# Altium schematic sheet pH-meter.SchDoc
size A4
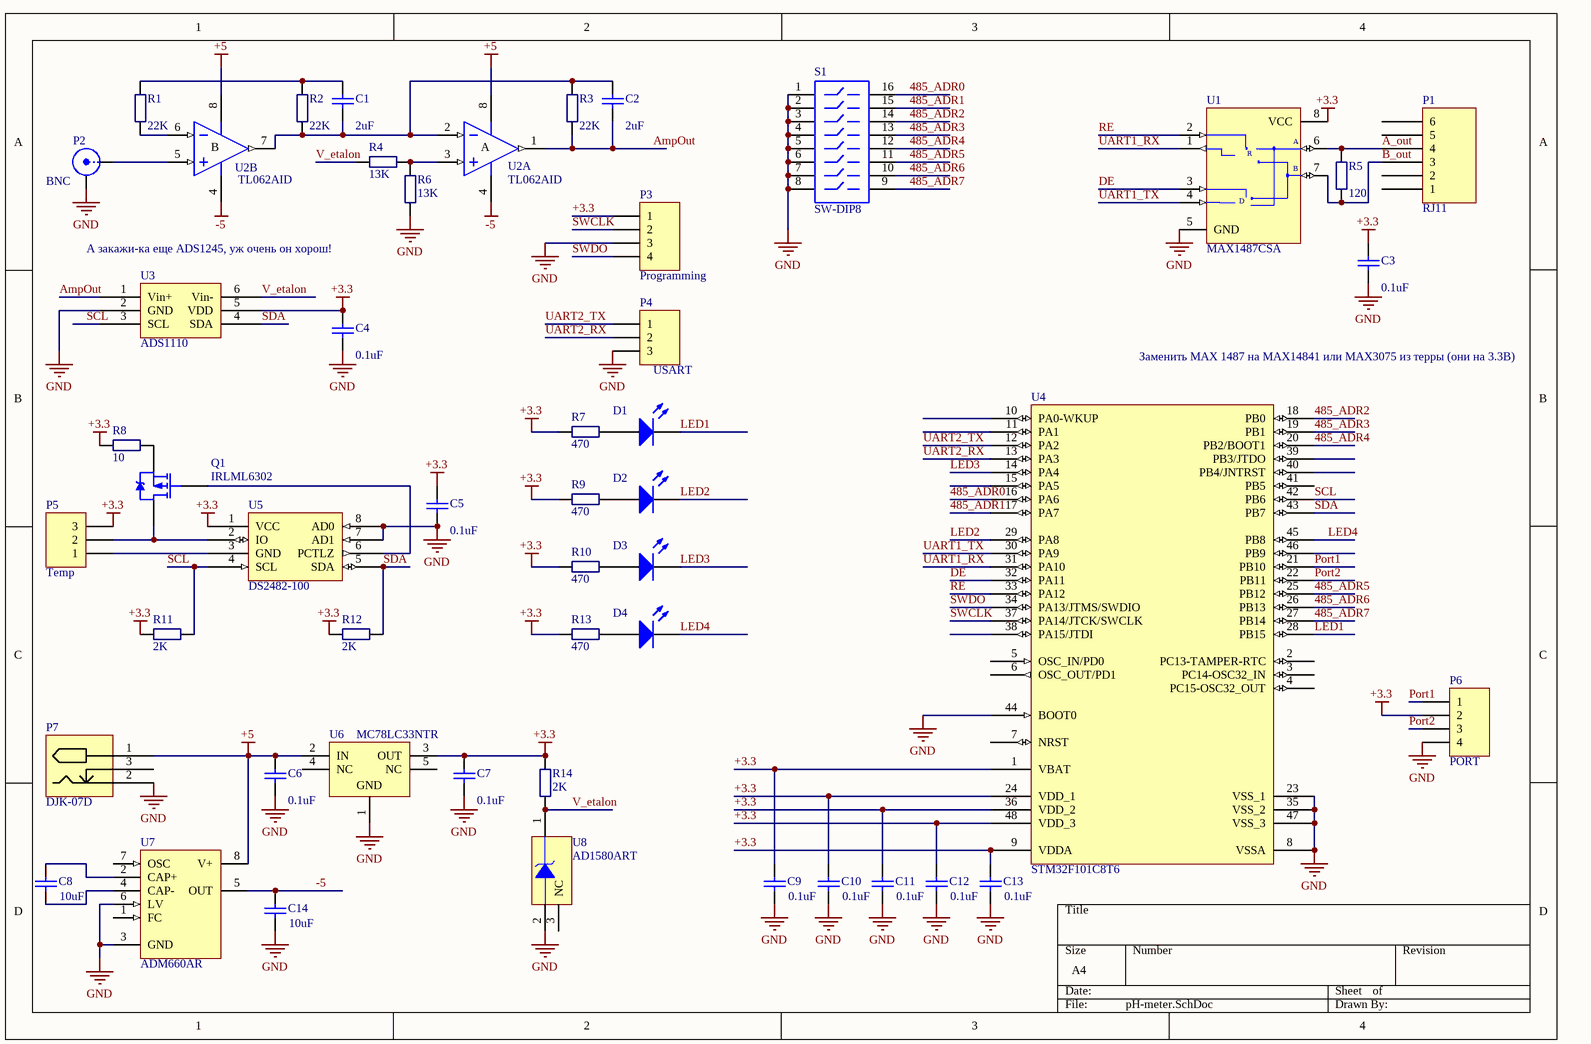
[diagram p0: pH-meter.SchDoc]

## Parts
C1  value 2uF  [1608[0603]]  (hidden comment: Cap Semi)
C2  value 2uF  [1608[0603]]  (hidden comment: Cap Semi)
C3  value 0.1uF  [1608[0603]]  (hidden comment: Cap Semi)
C4  value 0.1uF  [1608[0603]]  (hidden comment: Cap Semi)
C5  value 0.1uF  [1608[0603]]  (hidden comment: Cap Semi)
C6  value 0.1uF  [1608[0603]]  (hidden comment: Cap Semi)
C7  value 0.1uF  [1608[0603]]  (hidden comment: Cap Semi)
C8  value 10uF  [1608[0603]]  (hidden comment: Cap Semi)
C9  0.1uF  [1608[0603]]
C10  0.1uF  [1608[0603]]
C11  0.1uF  [1608[0603]]
C12  0.1uF  [1608[0603]]
C13  0.1uF  [1608[0603]]
C14  value 10uF  [1608[0603]]  (hidden comment: Cap Semi)
D1  LED1  [LED-1]  (value not drawn)
D2  LED1  [LED-1]  (value not drawn)
D3  LED1  [LED-1]  (value not drawn)
D4  LED1  [LED-1]  (value not drawn)
P1  RJ11  [RJ11_6]
P2  BNC  [BNC_RA CON]
P3  Programming  [HDR1X4]
P4  USART  [HDR1X3]
P5  Temp  [HDR1X3]
P6  PORT  [HDR1X4]
P7  DJK-07D  [DJK-07D]
Q1  IRLML6302  [SOT-23_N]
R1  value 22K  [J1-0603]  (hidden comment: Res_SMD)
R2  value 22K  [J1-0603]  (hidden comment: Res_SMD)
R3  value 22K  [J1-0603]  (hidden comment: Res_SMD)
R4  value 13K  [J1-0603]  (hidden comment: Res_SMD)
R5  value 120  [J1-0603]  (hidden comment: Res_SMD)
R6  value 13K  [J1-0603]  (hidden comment: Res_SMD)
R7  470  [J1-0603]
R8  value 10  [J1-0603]  (hidden comment: Res_SMD)
R9  470  [J1-0603]
R10  470  [J1-0603]
R11  value 2K  [J1-0603]  (hidden comment: Res_SMD)
R12  value 2K  [J1-0603]  (hidden comment: Res_SMD)
R13  470  [J1-0603]
R14  value 2K  [J1-0603]  (hidden comment: Res_SMD)
S1  SW-DIP8  [DIP-16-KEY]
U1  MAX1487CSA  [NSO8_N]
U2  TL062AID  [SO8_N]  (parts A,B of 2)
U3  ADS1110  [SOT-23_A]
U4  STM32F101C8T6  [LQFP48_N]
U5  DS2482-100  [NSO8_L]
U6  MC78LC33NTR  [1212-01]
U7  ADM660AR  [SO-8_N]
U8  AD1580ART  [RT-3_N]

## Nets
+3.3: C3.2 C4.2 C5.2 C7.2 C9.2 C10.2 C11.2 C12.2 C13.2 P3.1 P5.3 P6.2 R7.2 R8.1 R9.2 R10.2 R11.2 R12.2 R13.2 R14.2 U1.8(VCC) U3.5(VDD) U4.1(VBAT) U4.9(VDDA) U4.24(VDD_1) U4.36(VDD_2) U4.48(VDD_3) U5.1(VCC) U6.3(OUT)
+5: C6.2 P7.1 U2.8(V+) U6.2(IN) U7.8(V+)
-5: C14.2 U2.4(V-) U7.5(OUT)
GND: C3.1 C4.1 C5.1 C6.1 C7.1 C9.1 C10.1 C11.1 C12.1 C13.1 C14.1 P2.2(Y) P3.3 P4.3 P6.4 P7.2 R6.1 S1.1 S1.2 S1.3 S1.4 S1.5 S1.6 S1.7 S1.8 U1.5(GND) U3.2(GND) U4.8(VSSA) U4.23(VSS_1) U4.35(VSS_2) U4.44(BOOT0) U4.47(VSS_3) U5.7(AD1) U5.8(AD0) U6.1(GND) U7.3(GND) U7.6(LV) U8.2(V-)
485_ADR0: S1.16 U4.16(PA6)
485_ADR1: S1.15 U4.17(PA7)
485_ADR2: S1.14 U4.18(PB0)
485_ADR3: S1.13 U4.19(PB1)
485_ADR4: S1.12 U4.20(PB2/BOOT1)
485_ADR5: S1.11 U4.25(PB12)
485_ADR6: S1.10 U4.26(PB13)
485_ADR7: S1.9 U4.27(PB14)
A_out: P1.4 R5.1 U1.6(A)
AmpOut: C2.1 R3.2 U2.1(OUT) U3.1(Vin+)
B_out: P1.3 R5.2 U1.7(B)
DE: U1.3(DE) U4.32(PA11)
LED1: D1.2(K) U4.28(PB15)
LED2: D2.2(K) U4.29(PA8)
LED3: D3.2(K) U4.14(PA4)
LED4: D4.2(K) U4.45(PB8)
Port1: P6.1 U4.21(PB10)
Port2: P6.3 U4.22(PB11)
RE: U1.2(~{RE}) U4.33(PA12)
SCL: R11.1 U3.3(SCL) U4.42(PB6) U5.4(SCL)
SDA: R12.1 U3.4(SDA) U4.43(PB7) U5.5(SDA)
SWCLK: P3.2 U4.37(PA14/JTCK/SWCLK)
SWDO: P3.4 U4.34(PA13/JTMS/SWDIO)
UART1_RX: U1.1(RO) U4.31(PA10)
UART1_TX: U1.4(DI) U4.30(PA9)
UART2_RX: P4.2 U4.13(PA3)
UART2_TX: P4.1 U4.12(PA2)
V_etalon: R4.1 R14.1 U3.6(Vin-) U8.1(V+)
NetC1_1: C1.1 C2.2 R2.2 R3.1 U2.2(IN-) U2.7(OUT)
NetC1_2: C1.2 R1.1 R2.1
NetC8_1: C8.1 U7.4(CAP-)
NetC8_2: C8.2 U7.2(CAP+)
NetD1_1: D1.1(A) R7.1
NetD2_1: D2.1(A) R9.1
NetD3_1: D3.1(A) R10.1
NetD4_1: D4.1(A) R13.1
NetP2_1: P2.1(X) U2.5(IN+)
NetP5_1: P5.1 U5.3(GND)
NetP5_2: P5.2 Q1.3(D) U5.2(IO)
NetQ1_1: Q1.1(G) U5.6(PCTLZ)
NetQ1_2: Q1.2(S) R8.2
NetR1_2: R1.2 U2.6(IN-)
NetR4_2: R4.2 R6.2 U2.3(IN+)

Not connected (* = marked no-connect by the designer): P1 1 2 5 6; P7 3; U4 2(PC13-TAMPER-RTC) 3(PC14-OSC32_IN) 4(PC15-OSC32_OUT) 5(OSC_IN/PD0) 6(OSC_OUT/PD1) 7(NRST) 10(PA0-WKUP) 11(PA1) 15(PA5) 38(PA15/JTDI) 39(PB3/JTDO) 40(PB4/JNTRST) 41(PB5) 46(PB9); U6 4(NC) 5(NC); U7 1(FC) 7(OSC); U8 3(NC)

## Notes on the sheet
- (near U3) А закажи-ка еще ADS1245, уж очень он хорош!
- Заменить MAX 1487 на MAX14841 или MAX3075 из терры (они на 3.3В)
- (in symbol MAX1487CSA) R; D
- (in symbol TL062AID, part A) A
- (in symbol TL062AID, part B) B

## Library data of the parts
C1-C14 = Cap Semi: Capacitor (Semiconductor SIM Model); Published: 8-Jun-2000; LatestRevisionDate: 29-May-2009; LatestRevisionNote: IPC-7351 Footprint Added.; PackageReference: C1206; Publisher: Altium Limited; PackageDescription: Chip Capacitor
  C9-C13: Value: 0.1uF
D1-D4 = LED1: Typical RED GaAs LED; Published: 8-Jun-2000; LatestRevisionDate: 08-Jul-2005; LatestRevisionNote: Mech Layer 1 removed.; PackageReference: LED-1; Publisher: Altium Limited; PackageDescription: LED; 2 Leads
P1 = RJ11_6C: RJ11 6pin connector
P2 = BNC: BNC Elbow Connector; LatestRevisionDate: 17-Jul-2002; LatestRevisionNote: Re-released for DXP Platform.; Publisher: Altium Limited
P3 P6 = Header 4: Header, 4-Pin; LatestRevisionDate: 17-Jul-2002; LatestRevisionNote: Re-released for DXP Platform.; Publisher: Altium Limited
P4 P5 = Header 3: Header, 3-Pin; LatestRevisionDate: 17-Jul-2002; LatestRevisionNote: Re-released for DXP Platform.; Publisher: Altium Limited
P7 = DJK-07D: DJK-07D Разъем питания штырев. 1,3мм (п) на плату
Q1 = IRLML6302: HEXFET Power MOSFET; Published: 8-Jun-2000; LatestRevisionDate: 20-Nov-2009; LatestRevisionNote: IPC-7351 Footprint Added.; DatasheetVersion: Aug-1997; PackageReference: SOT-23; Publisher: Altium Limited; PackageDescription: 3-Pin SOT-23 Package 0.95 mm Pitch, 2.3 mm Lead Span; ComponentLink1Description: Manufacturer Link; ComponentLink1URL: http://www.irf.com/; ComponentLink2Description: Datasheet; ComponentLink2URL: http://www.irf.com/product-info/datasheets/data/irlml6302.pdf
R1-R14 = Res_SMD: Resistor; Published: 8-Jun-2000; LatestRevisionDate: 29-May-2009; LatestRevisionNote: IPC-7351 Footprint Added.; PackageReference: J1-0603; Publisher: Altium Limited; PackageDescription: Chip Resistor
  R7 R9 R10 R13: Value: 470
S1 = SW-DIP8: 4009 Series DIP Switch, Raised actuator; Published: 24-Mar-1999; LatestRevisionDate: 17-Dec-2003; LatestRevisionNote: PCB Footprint replaced.; PackageReference: DIP-16-KEY; Publisher: Altium Limited; PackageDescription: DIP; 16 Leads; Row Spacing 7.62 mm; Pitch 2.54 mm; ComponentLink1Description: Manufacturer Link; ComponentLink1URL: http://www.oupiin.com/prodindx.html#Headers
U1 = MAX1487CSA: Low-Power, Slew-Rate-Limited RS-485/RS-422 Transceiver; Published: 16-Jan-2001; LatestRevisionDate: 13-Apr-2006; LatestRevisionNote: IPC-7351 Footprint Added.; DatasheetVersion: Feb-1996; PackageReference: NSO8; Publisher: Altium Limited; PackageDescription: 8-Pin Small Outline Integrated Circuit 1.27 mm Pitch; Code_JEDEC: MS-012-AA; Code_IPC: SOIC127P600-8; ComponentLink1Description: Manufacturer Link; ComponentLink1URL: http://www.maxim-ic.com/; ComponentLink2Description: Datasheet; ComponentLink2URL: http://pdfserv.maxim-ic.com/en/ds/MAX1487-MAX491.pdf
U2 = TL062AID: Low-Power J-FET Dual Bipolar Operational Amplifier; Published: 24-Aug-2001; LatestRevisionDate: 13-Apr-2006; LatestRevisionNote: IPC-7351 Footprint Added.; DatasheetVersion: Oct-1997; PackageVersion: Dec-2002; PackageReference: SO8; Publisher: Altium Limited; PackageDescription: 8-Pin Small Outline Integrated Circuit 1.27 mm Pitch; Code_JEDEC: MS-012-AA; Code_IPC: SOIC127P600-8; ComponentLink1Description: Manufacturer Link; ComponentLink1URL: http://www.st.com/; ComponentLink2Description: Datasheet; ComponentLink2URL: http://www.st.com/stonline/products/literature/ds/2294/tl062.pdf
U3 = ADS1110: 16-Bit ANALOG-TO-DIGITAL CONVERTER
U4 = STM32F101C8T6: STM32 ARM-based 32-bit MCU with 64 Kbytes Flash, 48-pin LQFP, Industrial Temperature; Published: 30-May-2008; DatasheetVersion: rev6, Mar-2008; PackageVersion: Mar-2008; PackageReference: LQFP48; Publisher: Altium Limited; PackageDescription: 48-Pin Low-Profile Quad Flat Pack, 7 x 7 mm Body, 0.5 mm Pitch (LQFP48); ComponentLink1Description: Manufacturer Link; ComponentLink1URL: www.st.com/stm32; ComponentLink2Description: Datasheet; ComponentLink2URL: http://www.st.com/stonline/products/literature/ds/13586.pdf
U5 = DS2482-100: Single-Channel 1-Wire Master
U6 = MC78LC33NTR: Micropower Voltage Regulator; Published: 15-Apr-2002; DatasheetVersion: 1998; PackageVersion: Jul-1999; PackageReference: 1212-01; Publisher: Altium Limited; PackageDescription: SOT-23/SC-74A; 5 Leads; Body 3 x 3.1 mm, inc. leads (LxW max); ComponentLink1Description: Manufacturer Link; ComponentLink1URL: http://www.onsemi.com/site/products/taxonomy/0,4438,503,00.html; ComponentLink2Description: Datasheet; ComponentLink2URL: http://www.onsemi.com/pub/Collateral/MC78LC00-D.PDF
U7 = ADM660AR: CMOS Switched-Capacitor Voltage Converter; Published: 8-Jun-2000; LatestRevisionDate: 13-Apr-2006; LatestRevisionNote: IPC-7351 Footprint Added.; DatasheetVersion: REV.A 1997; PackageVersion: revA; PackageReference: SO-8; Publisher: Altium Limited; PackageDescription: 8-Pin Small Outline Integrated Circuit 1.27 mm Pitch; Code_JEDEC: MS-012-AA; Code_IPC: SOIC127P600-8; ComponentLink1Description: Manufacturer Link; ComponentLink1URL: http://www.analog.com/en/prod/0%2C2877%2CADM660%2C00.html; ComponentLink2Description: Datasheet; ComponentLink2URL: http://www.analog.com/UploadedFiles/Data_Sheets/79988481ADM660_8660_b.pdf
U8 = AD1580ART: 1.2V Micropower, Precision Shunt Voltage Reference; Note: Pin 3 is not connected or GND; Published: 8-Jun-2000; LatestRevisionDate: 29-May-2009; LatestRevisionNote: IPC-7351 Footprint Added.; DatasheetVersion: REV. 0 1995; PackageVersion: rev0; PackageReference: RT-3; Publisher: Altium Limited; PackageDescription: 3-Pin SOT-23 Package 0.95 mm Pitch, 2.4 mm Lead Span; ComponentLink1Description: Manufacturer Link; ComponentLink1URL: http://www.analog.com/en/prod/0%2C2877%2CAD1580%2C00.html; ComponentLink2Description: Datasheet; ComponentLink2URL: http://www.analog.com/UploadedFiles/Data_Sheets/501400529AD1580_b.pdf